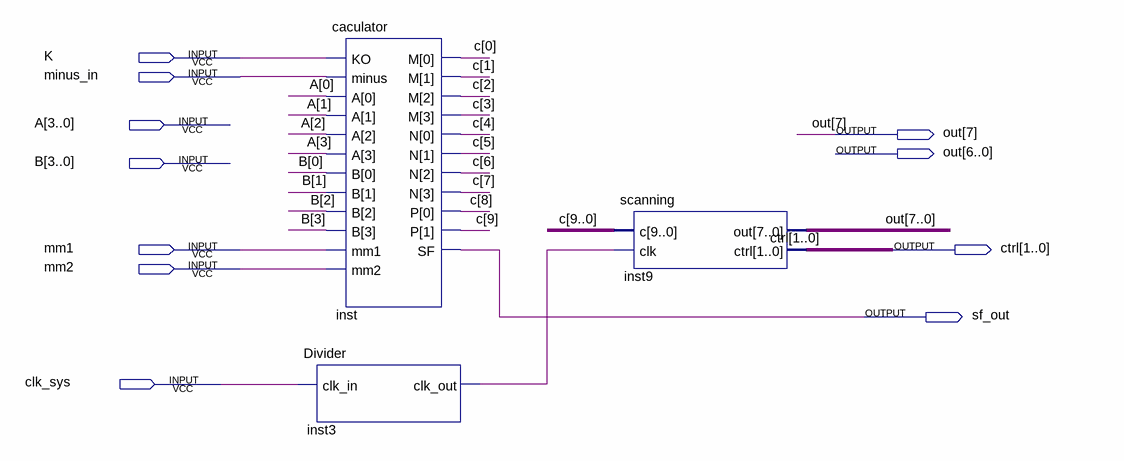
[diagram p0: schematic sheet]
// Quartus schematic scanner.bdf as structural Verilog: 3 symbols, 11 pins
module scanner (
  input  K,
  input  minus_in,
  input  [3:0] A,
  input  [3:0] B,
  input  mm1,
  input  mm2,
  input  clk_sys,
  output [7:0] out,
  output [1:0] ctrl,
  output sf_out
);

  wire inst3_clk_out;
  wire [9:0] c;

  Divider inst3 (.clk_in(clk_sys), .clk_out(inst3_clk_out));
  caculator inst (
    .KO(K), .minus(minus_in), .A(A), .B(B), .mm1(mm1), .mm2(mm2), .M(c[3:0]), .N(c[7:4]), .P(c[9:8]),
    .SF(sf_out));
  scanning inst9 (.c(c), .clk(inst3_clk_out), .out(out), .ctrl(ctrl));
endmodule
